# Altium schematic sheet Host_FPGA.SchDoc: Host Controller - Spartan3AN-400
size A2; Organization: Altium Limited.; Address1: Level 3, 12a Rodborough Rd; Address2: Frenchs Forest 2086; Address3: NSW; Address4: AUSTRALIA; DocumentNumber: 28; Revision: 6; SheetNumber: 29; SheetTotal: 78; PageSetup: Record=PageOptions|CenterHorizontal=True|CenterVertical=True|PrintScale=0.47|XCorrection=1.00|YCorrection=1.00|PrintKind=0|BorderSize=5000000|LeftOffset=0|BottomOffset=0|Orientation=2|PaperLength=1000|PaperWidth=1000|Scale=100|PaperSource=7|PrintQuality=1200|MediaType=1|DitherType=10|PaperKind=A4 (210 x 297 mm)|PrintScaleMode=1
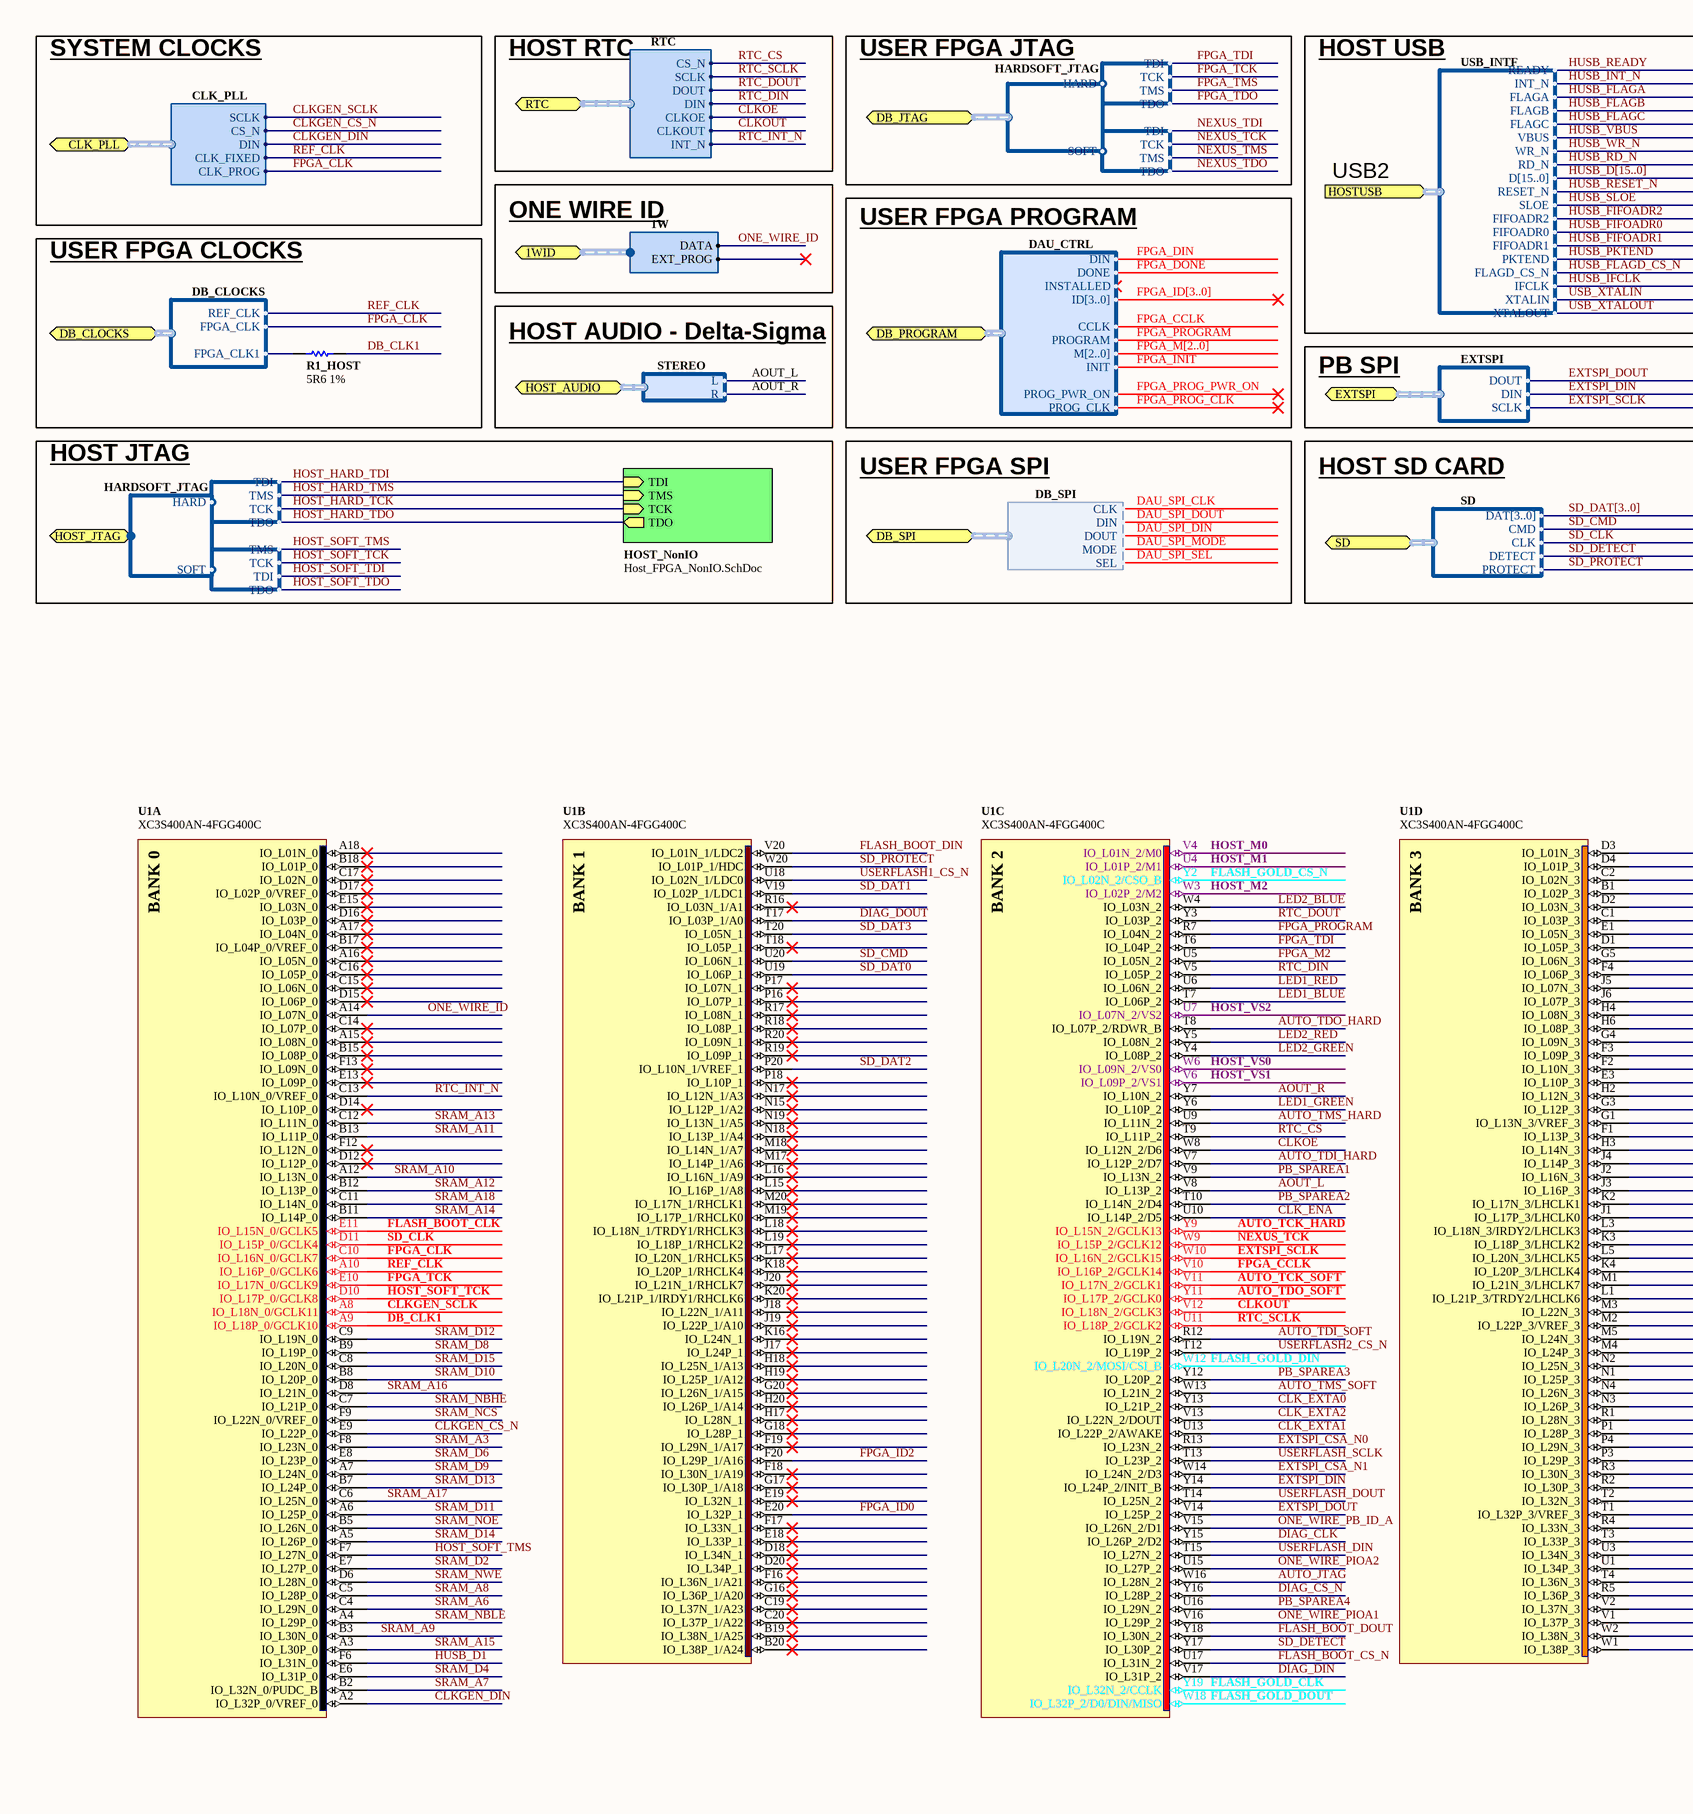
[diagram p0: Host_FPGA.SchDoc, left]
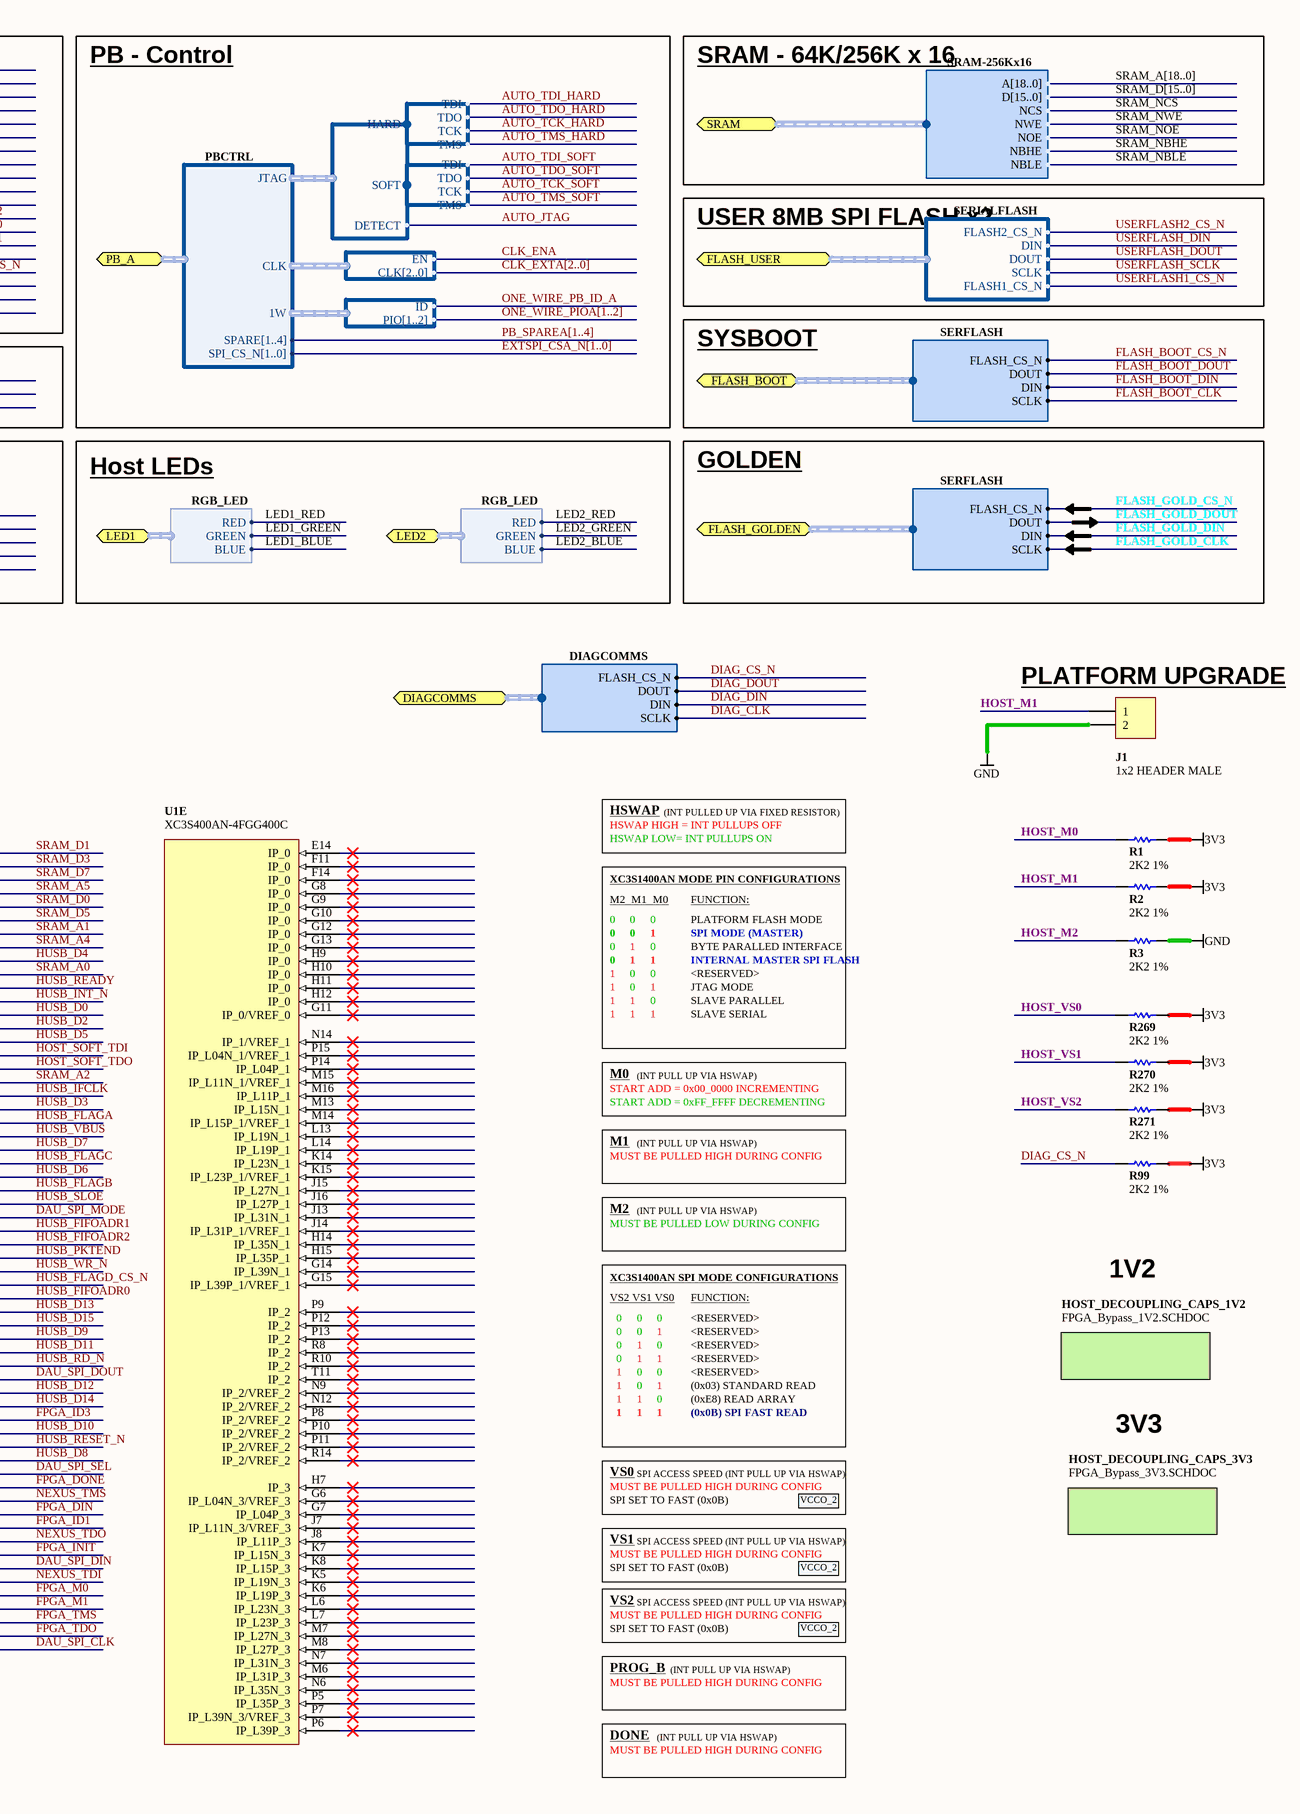
[diagram p1: Host_FPGA.SchDoc, right]

## Parts
J1  1x2 HEADER MALE  [HDR1X2]
R1  2K2 1%  [RESC1005-STAR]
R1_HOST  5R6 1%  [RESC1005-STAR]
R2  2K2 1%  [RESC1005-STAR]
R3  2K2 1%  [RESC1005-STAR]
R99  2K2 1%  [RESC1005-STAR]
R269  2K2 1%  [RESC1005-STAR]
R270  2K2 1%  [RESC1005-STAR]
R271  2K2 1%  [RESC1005-STAR]
U1  XC3S400AN-4FGG400C  [FGG400]  (parts A,B,C,D,E of 8)

## Blocks framed on the sheet
USER FPGA CLOCKS: R1_HOST

## Sub-sheets
HOST_DECOUPLING_CAPS_1V2 = FPGA_Bypass_1V2.SCHDOC: no entries
HOST_DECOUPLING_CAPS_3V3 = FPGA_Bypass_3V3.SCHDOC: no entries
HOST_NonIO = Host_FPGA_NonIO.SchDoc: TMS (in), TCK (in), TDI (in), TDO (out)

## Ports
1WID (harness 1W), CLK_PLL (harness CLK_PLL), DB_CLOCKS (harness DB_CLOCKS), DB_JTAG (harness HARDSOFT_JTAG), DB_PROGRAM (harness DAU_CTRL), DB_SPI (harness DB_SPI), DIAGCOMMS (harness DIAGCOMMS), EXTSPI (harness EXTSPI), FLASH_BOOT (harness SERFLASH), FLASH_GOLDEN (harness SERFLASH), FLASH_USER (harness SERIALFLASH), HOST_AUDIO (harness STEREO), HOST_JTAG (harness HARDSOFT_JTAG), HOSTUSB (harness USB_INTF), LED1 (harness RGB_LED), LED2 (harness RGB_LED), PB_A (harness PBCTRL), RTC (harness RTC), SD (harness SD), SRAM (harness SRAM-256Kx16)

## Harnesses
SERIALFLASH: FLASH2_CS_N, DIN, DOUT, SCLK, FLASH1_CS_N
JTAG: TMS, TDO, TDI, TCK
HARDSOFT_JTAG: HARD, SOFT
SD: DAT[3..0], CMD, CLK, DETECT, PROTECT
STEREO: L, R
RTC: CS_N, DIN, DOUT, INT_N, SCLK, CLKOUT, CLKOE
DAU_CTRL: DIN, DONE, INSTALLED, ID[3..0], CCLK, PROGRAM, M[2..0], INIT, PROG_PWR_ON, PROG_CLK
1W: DATA, EXT_PROG
CLK_PLL: CLK_FIXED, CLK_PROG, CS_N, DIN, SCLK
SRAM-256Kx16: A[18..0], D[15..0], NCS, NWE, NOE, NBHE, NBLE
RGB_LED: GREEN, RED, BLUE
DB_CLOCKS: REF_CLK, FPGA_CLK, FPGA_CLK1
DB_SPI: MODE, SEL, CLK, DIN, DOUT
JTAG_CONFIG: HARD, SOFT, DETECT
JTAG: TDI, TDO, TCK, TMS
GATE_CLOCKS: EN, CLK[2..0]
ONE_WIRE: ID, PIO[1..2]
PBCTRL: JTAG, CLK, 1W, SPI_CS_N[1..0], SPARE[1..4]
EXTSPI: DOUT, DIN, SCLK
SERFLASH: DIN, DOUT, SCLK, FLASH_CS_N
USB_INTF: READY, INT_N, SLOE, FIFOADR2, FIFOADR0, FIFOADR1, PKTEND, FLAGD_CS_N, FLAGA, FLAGB, FLAGC, WR_N, RD_N, D[15..0], RESET_N, IFCLK, XTALIN, VBUS, XTALOUT
DIAGCOMMS: DIN, DOUT, SCLK, FLASH_CS_N

## Nets
3V3: R1.2 R2.2 R99.2 R269.2 R270.2 R271.2
GND: J1.2 R3.2
AOUT_L: U1.V8(IO_L13P_2) ; port HOST_AUDIO.L
AOUT_R: U1.Y7(IO_L10N_2) ; port HOST_AUDIO.R
AUTO_JTAG: U1.W16(IO_L28N_2) ; harness JTAG_CONFIG.DETECT
AUTO_TCK_HARD: U1.Y9(IO_L15N_2/GCLK13) ; harness JTAG.TCK
AUTO_TCK_SOFT: U1.V11(IO_L17N_2/GCLK1) ; harness JTAG.TCK
AUTO_TDI_HARD: U1.V7(IO_L12P_2/D7) ; harness JTAG.TDI
AUTO_TDI_SOFT: U1.R12(IO_L19N_2) ; harness JTAG.TDI
AUTO_TDO_HARD: U1.T8(IO_L07P_2/RDWR_B) ; harness JTAG.TDO
AUTO_TDO_SOFT: U1.Y11(IO_L17P_2/GCLK0) ; harness JTAG.TDO
AUTO_TMS_HARD: U1.U9(IO_L11N_2) ; harness JTAG.TMS
AUTO_TMS_SOFT: U1.W13(IO_L21N_2) ; harness JTAG.TMS
CLK_ENA: U1.U10(IO_L14P_2/D5) ; harness GATE_CLOCKS.EN
CLK_EXTA0: U1.Y13(IO_L21P_2)
CLK_EXTA1: U1.U13(IO_L22P_2/AWAKE)
CLK_EXTA2: U1.V13(IO_L22N_2/DOUT)
CLKGEN_CS_N: U1.E9(IO_L22P_0) ; port CLK_PLL.CS_N
CLKGEN_DIN: U1.A2(IO_L32P_0/VREF_0) ; port CLK_PLL.DIN
CLKGEN_SCLK: U1.A8(IO_L18N_0/GCLK11) ; port CLK_PLL.SCLK
CLKOE: U1.W8(IO_L12N_2/D6) ; port RTC.CLKOE
CLKOUT: U1.V12(IO_L18N_2/GCLK3) ; port RTC.CLKOUT
DAU_SPI_CLK: U1.W1(IO_L38P_3) ; port DB_SPI.CLK
DAU_SPI_DIN: U1.U1(IO_L34P_3) ; port DB_SPI.DOUT
DAU_SPI_DOUT: U1.N1(IO_L25P_3) ; port DB_SPI.DIN
DAU_SPI_MODE: U1.J1(IO_L17P_3/LHCLK0) ; port DB_SPI.MODE
DAU_SPI_SEL: U1.R3(IO_L30N_3) ; port DB_SPI.SEL
DB_CLK1: R1_HOST.1 U1.A9(IO_L18P_0/GCLK10)
DIAG_CLK: U1.Y15(IO_L26P_2/D2) ; port DIAGCOMMS.SCLK
DIAG_CS_N: R99.1 U1.Y16(IO_L28P_2) ; port DIAGCOMMS.FLASH_CS_N
DIAG_DIN: U1.V17(IO_L31P_2) ; port DIAGCOMMS.DIN
DIAG_DOUT: U1.T17(IO_L03P_1/A0) ; port DIAGCOMMS.DOUT
EXTSPI_CSA_N0: U1.R13(IO_L23N_2)
EXTSPI_CSA_N1: U1.W14(IO_L24N_2/D3)
EXTSPI_DIN: U1.Y14(IO_L24P_2/INIT_B) ; port EXTSPI.DIN
EXTSPI_DOUT: U1.V14(IO_L25P_2) ; port EXTSPI.DOUT
EXTSPI_SCLK: U1.W10(IO_L16N_2/GCLK15) ; port EXTSPI.SCLK
FLASH_BOOT_CLK: U1.E11(IO_L15N_0/GCLK5) ; port FLASH_BOOT.SCLK
FLASH_BOOT_CS_N: U1.U17(IO_L31N_2) ; port FLASH_BOOT.FLASH_CS_N
FLASH_BOOT_DIN: U1.V20(IO_L01N_1/LDC2) ; port FLASH_BOOT.DIN
FLASH_BOOT_DOUT: U1.Y18(IO_L30N_2) ; port FLASH_BOOT.DOUT
FLASH_GOLD_CLK: U1.Y19(IO_L32N_2/CCLK) ; port FLASH_GOLDEN.SCLK
FLASH_GOLD_CS_N: U1.Y2(IO_L02N_2/CSO_B) ; port FLASH_GOLDEN.FLASH_CS_N
FLASH_GOLD_DIN: U1.W12(IO_L20N_2/MOSI/CSI_B) ; port FLASH_GOLDEN.DIN
FLASH_GOLD_DOUT: U1.W18(IO_L32P_2/D0/DIN/MISO) ; port FLASH_GOLDEN.DOUT
FPGA_CCLK: U1.V10(IO_L16P_2/GCLK14) ; port DB_PROGRAM.CCLK
FPGA_CLK: U1.C10(IO_L16N_0/GCLK7) ; port CLK_PLL.CLK_PROG, port DB_CLOCKS.FPGA_CLK
FPGA_DIN: U1.T1(IO_L32P_3/VREF_3) ; port DB_PROGRAM.DIN
FPGA_DONE: U1.R2(IO_L30P_3) ; port DB_PROGRAM.DONE
FPGA_ID0: U1.E20(IO_L32P_1)
FPGA_ID1: U1.R4(IO_L33N_3)
FPGA_ID2: U1.F20(IO_L29P_1/A16)
FPGA_ID3: U1.R1(IO_L28N_3)
FPGA_INIT: U1.U3(IO_L34N_3) ; port DB_PROGRAM.INIT
FPGA_M0: U1.R5(IO_L36P_3)
FPGA_M1: U1.V2(IO_L37N_3)
FPGA_M2: U1.U5(IO_L05N_2)
FPGA_PROG_CLK: port DB_PROGRAM.PROG_CLK
FPGA_PROG_PWR_ON: port DB_PROGRAM.PROG_PWR_ON
FPGA_PROGRAM: U1.R7(IO_L04N_2) ; port DB_PROGRAM.PROGRAM
FPGA_TCK: U1.E10(IO_L17N_0/GCLK9) ; harness JTAG.TCK
FPGA_TDI: U1.T6(IO_L04P_2) ; harness JTAG.TDI
FPGA_TDO: U1.W2(IO_L38N_3) ; harness JTAG.TDO
FPGA_TMS: U1.V1(IO_L37P_3) ; harness JTAG.TMS
HOST_HARD_TCK: sheet HOST_NonIO/TCK, harness JTAG.TCK
HOST_HARD_TDI: sheet HOST_NonIO/TDI, harness JTAG.TDI
HOST_HARD_TDO: sheet HOST_NonIO/TDO, harness JTAG.TDO
HOST_HARD_TMS: sheet HOST_NonIO/TMS, harness JTAG.TMS
HOST_M0: R1.1 U1.V4(IO_L01N_2/M0)
HOST_M1: J1.1 R2.1 U1.U4(IO_L01P_2/M1)
HOST_M2: R3.1 U1.W3(IO_L02P_2/M2)
HOST_SOFT_TCK: U1.D10(IO_L17P_0/GCLK8) ; harness JTAG.TCK
HOST_SOFT_TDI: U1.F3(IO_L09P_3) ; harness JTAG.TDI
HOST_SOFT_TDO: U1.F2(IO_L10N_3) ; harness JTAG.TDO
HOST_SOFT_TMS: U1.F7(IO_L27N_0) ; harness JTAG.TMS
HOST_VS0: R269.1 U1.W6(IO_L09N_2/VS0)
HOST_VS1: R270.1 U1.V6(IO_L09P_2/VS1)
HOST_VS2: R271.1 U1.U7(IO_L07N_2/VS2)
HUSB_D0: U1.H4(IO_L08N_3)
HUSB_D1: U1.F6(IO_L31N_0)
HUSB_D2: U1.H6(IO_L08P_3)
HUSB_D3: U1.G3(IO_L12P_3)
HUSB_D4: U1.G5(IO_L06N_3)
HUSB_D5: U1.G4(IO_L09N_3)
HUSB_D6: U1.J2(IO_L16N_3)
HUSB_D7: U1.H3(IO_L14N_3)
HUSB_D8: U1.P3(IO_L29P_3)
HUSB_D9: U1.M5(IO_L24N_3)
HUSB_D10: U1.P1(IO_L28P_3)
HUSB_D11: U1.M4(IO_L24P_3)
HUSB_D12: U1.N4(IO_L26N_3)
HUSB_D13: U1.M3(IO_L22N_3)
HUSB_D14: U1.N3(IO_L26P_3)
HUSB_D15: U1.M2(IO_L22P_3/VREF_3)
HUSB_FIFOADR0: U1.L1(IO_L21P_3/TRDY2/LHCLK6) ; port HOSTUSB.FIFOADR0
HUSB_FIFOADR1: U1.L3(IO_L18N_3/IRDY2/LHCLK3) ; port HOSTUSB.FIFOADR1
HUSB_FIFOADR2: U1.K3(IO_L18P_3/LHCLK2) ; port HOSTUSB.FIFOADR2
HUSB_FLAGA: U1.G1(IO_L13N_3/VREF_3) ; port HOSTUSB.FLAGA
HUSB_FLAGB: U1.J3(IO_L16P_3) ; port HOSTUSB.FLAGB
HUSB_FLAGC: U1.J4(IO_L14P_3) ; port HOSTUSB.FLAGC
HUSB_FLAGD_CS_N: U1.M1(IO_L21N_3/LHCLK7) ; port HOSTUSB.FLAGD_CS_N
HUSB_IFCLK: U1.H2(IO_L12N_3) ; port HOSTUSB.IFCLK
HUSB_INT_N: U1.J6(IO_L07P_3) ; port HOSTUSB.INT_N
HUSB_PKTEND: U1.L5(IO_L20N_3/LHCLK5) ; port HOSTUSB.PKTEND
HUSB_RD_N: U1.N2(IO_L25N_3) ; port HOSTUSB.RD_N
HUSB_READY: U1.J5(IO_L07N_3) ; port HOSTUSB.READY
HUSB_RESET_N: U1.P4(IO_L29N_3) ; port HOSTUSB.RESET_N
HUSB_SLOE: U1.K2(IO_L17N_3/LHCLK1) ; port HOSTUSB.SLOE
HUSB_VBUS: U1.F1(IO_L13P_3) ; port HOSTUSB.VBUS
HUSB_WR_N: U1.K4(IO_L20P_3/LHCLK4) ; port HOSTUSB.WR_N
LED1_BLUE: U1.T7(IO_L06P_2) ; port LED1.BLUE
LED1_GREEN: U1.Y6(IO_L10P_2) ; port LED1.GREEN
LED1_RED: U1.U6(IO_L06N_2) ; port LED1.RED
LED2_BLUE: U1.W4(IO_L03N_2) ; port LED2.BLUE
LED2_GREEN: U1.Y4(IO_L08P_2) ; port LED2.GREEN
LED2_RED: U1.Y5(IO_L08N_2) ; port LED2.RED
NEXUS_TCK: U1.W9(IO_L15P_2/GCLK12) ; harness JTAG.TCK
NEXUS_TDI: U1.T4(IO_L36N_3) ; harness JTAG.TDI
NEXUS_TDO: U1.T3(IO_L33P_3) ; harness JTAG.TDO
NEXUS_TMS: U1.T2(IO_L32N_3) ; harness JTAG.TMS
ONE_WIRE_ID: U1.A14(IO_L07N_0) ; port 1WID.DATA
ONE_WIRE_PB_ID_A: U1.V15(IO_L26N_2/D1) ; harness ONE_WIRE.ID
ONE_WIRE_PIOA1: U1.V16(IO_L29P_2)
ONE_WIRE_PIOA2: U1.U15(IO_L27P_2)
PB_SPAREA1: U1.V9(IO_L13N_2)
PB_SPAREA2: U1.T10(IO_L14N_2/D4)
PB_SPAREA3: U1.Y12(IO_L20P_2)
PB_SPAREA4: U1.U16(IO_L29N_2)
REF_CLK: U1.A10(IO_L16P_0/GCLK6) ; port CLK_PLL.CLK_FIXED, port DB_CLOCKS.REF_CLK
RTC_CS: U1.T9(IO_L11P_2) ; port RTC.CS_N
RTC_DIN: U1.V5(IO_L05P_2) ; port RTC.DIN
RTC_DOUT: U1.Y3(IO_L03P_2) ; port RTC.DOUT
RTC_INT_N: U1.C13(IO_L10N_0/VREF_0) ; port RTC.INT_N
RTC_SCLK: U1.U11(IO_L18P_2/GCLK2) ; port RTC.SCLK
SD_CLK: U1.D11(IO_L15P_0/GCLK4) ; port SD.CLK
SD_CMD: U1.U20(IO_L06N_1) ; port SD.CMD
SD_DAT0: U1.U19(IO_L06P_1)
SD_DAT1: U1.V19(IO_L02P_1/LDC1)
SD_DAT2: U1.P20(IO_L10N_1/VREF_1)
SD_DAT3: U1.T20(IO_L05N_1)
SD_DETECT: U1.Y17(IO_L30P_2) ; port SD.DETECT
SD_PROTECT: U1.W20(IO_L01P_1/HDC) ; port SD.PROTECT
SRAM_A0: U1.F4(IO_L06P_3)
SRAM_A1: U1.E1(IO_L05N_3)
SRAM_A2: U1.E3(IO_L10P_3)
SRAM_A3: U1.F8(IO_L23N_0)
SRAM_A4: U1.D1(IO_L05P_3)
SRAM_A5: U1.B1(IO_L02P_3)
SRAM_A6: U1.C4(IO_L29N_0)
SRAM_A7: U1.B2(IO_L32N_0/PUDC_B)
SRAM_A8: U1.C5(IO_L28P_0)
SRAM_A9: U1.B3(IO_L30N_0)
SRAM_A10: U1.A12(IO_L13N_0)
SRAM_A11: U1.B13(IO_L11P_0)
SRAM_A12: U1.B12(IO_L13P_0)
SRAM_A13: U1.C12(IO_L11N_0)
SRAM_A14: U1.B11(IO_L14P_0)
SRAM_A15: U1.A3(IO_L30P_0)
SRAM_A16: U1.D8(IO_L21N_0)
SRAM_A17: U1.C6(IO_L25N_0)
SRAM_A18: U1.C11(IO_L14N_0)
SRAM_D0: U1.D2(IO_L03N_3)
SRAM_D1: U1.D3(IO_L01N_3)
SRAM_D2: U1.E7(IO_L27P_0)
SRAM_D3: U1.D4(IO_L01P_3)
SRAM_D4: U1.E6(IO_L31P_0)
SRAM_D5: U1.C1(IO_L03P_3)
SRAM_D6: U1.E8(IO_L23P_0)
SRAM_D7: U1.C2(IO_L02N_3)
SRAM_D8: U1.B9(IO_L19P_0)
SRAM_D9: U1.A7(IO_L24N_0)
SRAM_D10: U1.B8(IO_L20P_0)
SRAM_D11: U1.A6(IO_L25P_0)
SRAM_D12: U1.C9(IO_L19N_0)
SRAM_D13: U1.B7(IO_L24P_0)
SRAM_D14: U1.A5(IO_L26P_0)
SRAM_D15: U1.C8(IO_L20N_0)
SRAM_NBHE: U1.C7(IO_L21P_0) ; port SRAM.NBHE
SRAM_NBLE: U1.A4(IO_L29P_0) ; port SRAM.NBLE
SRAM_NCS: U1.F9(IO_L22N_0/VREF_0) ; port SRAM.NCS
SRAM_NOE: U1.B5(IO_L26N_0) ; port SRAM.NOE
SRAM_NWE: U1.D6(IO_L28N_0) ; port SRAM.NWE
USB_XTALIN: port HOSTUSB.XTALIN
USB_XTALOUT: port HOSTUSB.XTALOUT
USERFLASH1_CS_N: U1.U18(IO_L02N_1/LDC0) ; port FLASH_USER.FLASH1_CS_N
USERFLASH2_CS_N: U1.T12(IO_L19P_2) ; port FLASH_USER.FLASH2_CS_N
USERFLASH_DIN: U1.T15(IO_L27N_2) ; port FLASH_USER.DIN
USERFLASH_DOUT: U1.T14(IO_L25N_2) ; port FLASH_USER.DOUT
USERFLASH_SCLK: U1.T13(IO_L23P_2) ; port FLASH_USER.SCLK
NetR1_HOST_2: R1_HOST.2 ; port DB_CLOCKS.FPGA_CLK1

Not connected (* = marked no-connect by the designer): U1 A15(IO_L08N_0)* A16(IO_L05N_0)* A17(IO_L04N_0)* A18(IO_L01N_0)* B15(IO_L08P_0)* B17(IO_L04P_0/VREF_0)* B18(IO_L01P_0)* B19(IO_L38N_1/A25)* B20(IO_L38P_1/A24)* C14(IO_L07P_0)* C15(IO_L06N_0)* C16(IO_L05P_0)* C17(IO_L02N_0)* C19(IO_L37N_1/A23)* C20(IO_L37P_1/A22)* D12(IO_L12P_0)* D14(IO_L10P_0)* D15(IO_L06P_0)* D16(IO_L03P_0)* D17(IO_L02P_0/VREF_0)* D18(IO_L34N_1)* D20(IO_L34P_1)* E13(IO_L09P_0)* E14(IP_0)* E15(IO_L03N_0)* E18(IO_L33P_1)* E19(IO_L32N_1)* F11(IP_0)* F12(IO_L12N_0)* F13(IO_L09N_0)* F14(IP_0)* F16(IO_L36N_1/A21)* F17(IO_L33N_1)* F18(IO_L30N_1/A19)* F19(IO_L29N_1/A17)* G6(IP_L04N_3/VREF_3)* G7(IP_L04P_3)* G8(IP_0)* G9(IP_0)* G10(IP_0)* G11(IP_0/VREF_0)* G12(IP_0)* G13(IP_0)* G14(IP_L39N_1)* G15(IP_L39P_1/VREF_1)* G16(IO_L36P_1/A20)* G17(IO_L30P_1/A18)* G18(IO_L28P_1)* G20(IO_L26N_1/A15)* H7(IP_3)* H9(IP_0)* H10(IP_0)* H11(IP_0)* H12(IP_0)* H14(IP_L35N_1)* H15(IP_L35P_1)* H17(IO_L28N_1)* H18(IO_L25N_1/A13)* H19(IO_L25P_1/A12)* H20(IO_L26P_1/A14)* J7(IP_L11N_3/VREF_3)* J8(IP_L11P_3)* J13(IP_L31N_1)* J14(IP_L31P_1/VREF_1)* J15(IP_L27N_1)* J16(IP_L27P_1)* J17(IO_L24P_1)* J18(IO_L22N_1/A11)* J19(IO_L22P_1/A10)* J20(IO_L21N_1/RHCLK7)* K5(IP_L19N_3)* K6(IP_L19P_3)* K7(IP_L15N_3)* K8(IP_L15P_3)* K14(IP_L23N_1)* K15(IP_L23P_1/VREF_1)* K16(IO_L24N_1)* K18(IO_L20P_1/RHCLK4)* K20(IO_L21P_1/IRDY1/RHCLK6)* L6(IP_L23N_3)* L7(IP_L23P_3)* L13(IP_L19N_1)* L14(IP_L19P_1)* L15(IO_L16P_1/A8)* L16(IO_L16N_1/A9)* L17(IO_L20N_1/RHCLK5)* L18(IO_L18N_1/TRDY1/RHCLK3)* L19(IO_L18P_1/RHCLK2)* M6(IP_L31P_3)* M7(IP_L27N_3)* M8(IP_L27P_3)* M13(IP_L15N_1)* M14(IP_L15P_1/VREF_1)* M15(IP_L11N_1/VREF_1)* M16(IP_L11P_1)* M17(IO_L14P_1/A6)* M18(IO_L14N_1/A7)* M19(IO_L17P_1/RHCLK0)* M20(IO_L17N_1/RHCLK1)* N6(IP_L35N_3)* N7(IP_L31N_3)* N9(IP_2/VREF_2)* N12(IP_2/VREF_2)* N14(IP_1/VREF_1)* N15(IO_L12P_1/A2)* N17(IO_L12N_1/A3)* N18(IO_L13P_1/A4)* N19(IO_L13N_1/A5)* P5(IP_L35P_3)* P6(IP_L39P_3)* P7(IP_L39N_3/VREF_3)* P8(IP_2/VREF_2)* P9(IP_2)* P10(IP_2/VREF_2)* P11(IP_2/VREF_2)* P12(IP_2)* P13(IP_2)* P14(IP_L04P_1)* P15(IP_L04N_1/VREF_1)* P16(IO_L07P_1)* P17(IO_L07N_1)* P18(IO_L10P_1)* R8(IP_2)* R10(IP_2)* R14(IP_2/VREF_2)* R16(IO_L03N_1/A1)* R17(IO_L08N_1)* R18(IO_L08P_1)* R19(IO_L09P_1)* R20(IO_L09N_1)* T11(IP_2)* T18(IO_L05P_1)*

## Buses and harness runs
bus CLK_EXTA[2..0]
bus EXTSPI_CSA_N[1..0]
bus FPGA_ID[3..0]
bus FPGA_M[2..0]
bus HUSB_D[15..0]
bus ONE_WIRE_PIOA[1..2]
bus PB_SPAREA[1..4]
bus SD_DAT[3..0]
bus SRAM_A[18..0]
bus SRAM_D[15..0]

## Notes on the sheet
- SYSTEM CLOCKS
- HOST RTC
- USER FPGA JTAG
- HOST USB
- PB - Control
- SRAM - 64K/256K x 16
- ONE WIRE ID
- USER FPGA PROGRAM
- USB2
- USER 8MB SPI FLASH x2
- HOST AUDIO - Delta-Sigma
- SYSBOOT
- PB SPI
- HOST JTAG
- USER FPGA SPI
- HOST SD CARD
- Host LEDs
- GOLDEN
- (near J1) PLATFORM UPGRADE
- HSWAP
- HSWAP HIGH = INT PULLUPS OFF
- (INT PULLED UP VIA FIXED RESISTOR)
- HSWAP LOW= INT PULLUPS ON
- XC3S1400AN MODE PIN CONFIGURATIONS
- M2  M1  M0
- FUNCTION:
- 0
- 1
- PLATFORM FLASH MODE
- SPI MODE (MASTER)
- BYTE PARALLED INTERFACE
- INTERNAL MASTER SPI FLASH
- <RESERVED>
- JTAG MODE
- SLAVE PARALLEL
- SLAVE SERIAL
- M0
- START ADD = 0x00_0000 INCREMENTING
- (INT PULL UP VIA HSWAP)
- START ADD = 0xFF_FFFF DECREMENTING
- M1
- MUST BE PULLED HIGH DURING CONFIG
- M2
- MUST BE PULLED LOW DURING CONFIG
- XC3S1400AN SPI MODE CONFIGURATIONS
- VS2 VS1 VS0
- 1V2
- (0x03) STANDARD READ
- (0xE8) READ ARRAY
- (0x0B) SPI FAST READ
- 3V3
- VS0
- SPI SET TO FAST (0x0B)
- SPI ACCESS SPEED (INT PULL UP VIA HSWAP)
- VCCO_2
- VS1
- VS2
- PROG_B
- DONE
- Project Title
- Sheet Title
- Size:
- Date:
- File:
- A2
- Assy:
- Time:
- Revision:
- Sheet
- of
- (in symbol D-241-0024, part A) BANK 0
- (in symbol D-241-0024, part B) BANK 1
- (in symbol D-241-0024, part C) BANK 2
- (in symbol D-241-0024, part D) BANK 3

## Library data of the parts
J1 = D-300-0020: Header IDC, 2 x 1 Pin Vertical 2.54mm Pitch (Non-Boxed, Male); Max Current: 3 A; Category: Connector; Connector type: Header; Mounting Technology: Through-Hole; Pin Count: 2; Status: Production
R1-R3 R99 R269-R271 = D-100-0107: Resistor, 2K2 1% 0402 (1005); Power Rating: 63 mW; Resistance: 2.2 K; Category: Resistor; Mounting Technology: Surface Mount; Status: Production; Tolerance: 1 %
R1_HOST = D-100-0085: Resistor, 5R6 1% 0402 (1005); Power Rating: 63 mW; Resistance: 5.6 R; Category: Resistor; Status: Production; Mounting Technology: Surface Mount; Tolerance: 1 %
U1 = D-241-0024: FPGA, Xilinx Spartan3-400 Standard Speed, BGA 1.0mm pitch, 400 balls, 0 to 85 degC; Supply Voltage: 1.2, 2.5, and 3.3 V; Mounting Technology: Surface Mount; Status: Unreleased; Technology: SRAM; Temperature Range: 0 to 85; Category: IC-FPGA; NexusDeviceId: XC3S400AN-4FGG400C